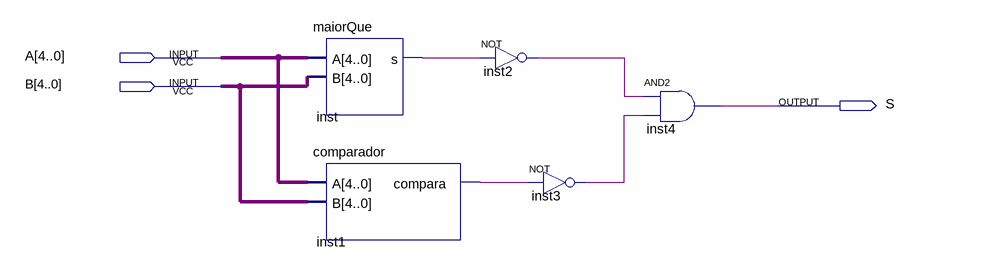
[diagram p0: schematic sheet]
// Quartus schematic menorQue.bdf as structural Verilog: 5 symbols, 3 pins
module menorQue (
  input  [4:0] A,
  input  [4:0] B,
  output S
);

  wire inst1_compara, inst2_out, inst3_out, inst_s;

  maiorQue inst (.A(A), .B(B), .s(inst_s));
  comparador inst1 (.A(A), .B(B), .compara(inst1_compara));
  not inst2 (inst2_out, inst_s);
  not inst3 (inst3_out, inst1_compara);
  and inst4 (S, inst2_out, inst3_out);
endmodule
